# EasyEDA Pro project ProPrj_FRC ESP32 CAN DevKit Lite_2025-11-01.epro, schematic Schematic1
Board Name: Board1; Create Date: 2025-10-21; Page Name: P1; Project Name: FRC ESP32 CAN DevKit Lite; Schematic Name: Schematic1; Update Date: 2025-10-25; Company: 嘉立创EDA; Page Size: A4; Version: V1.0
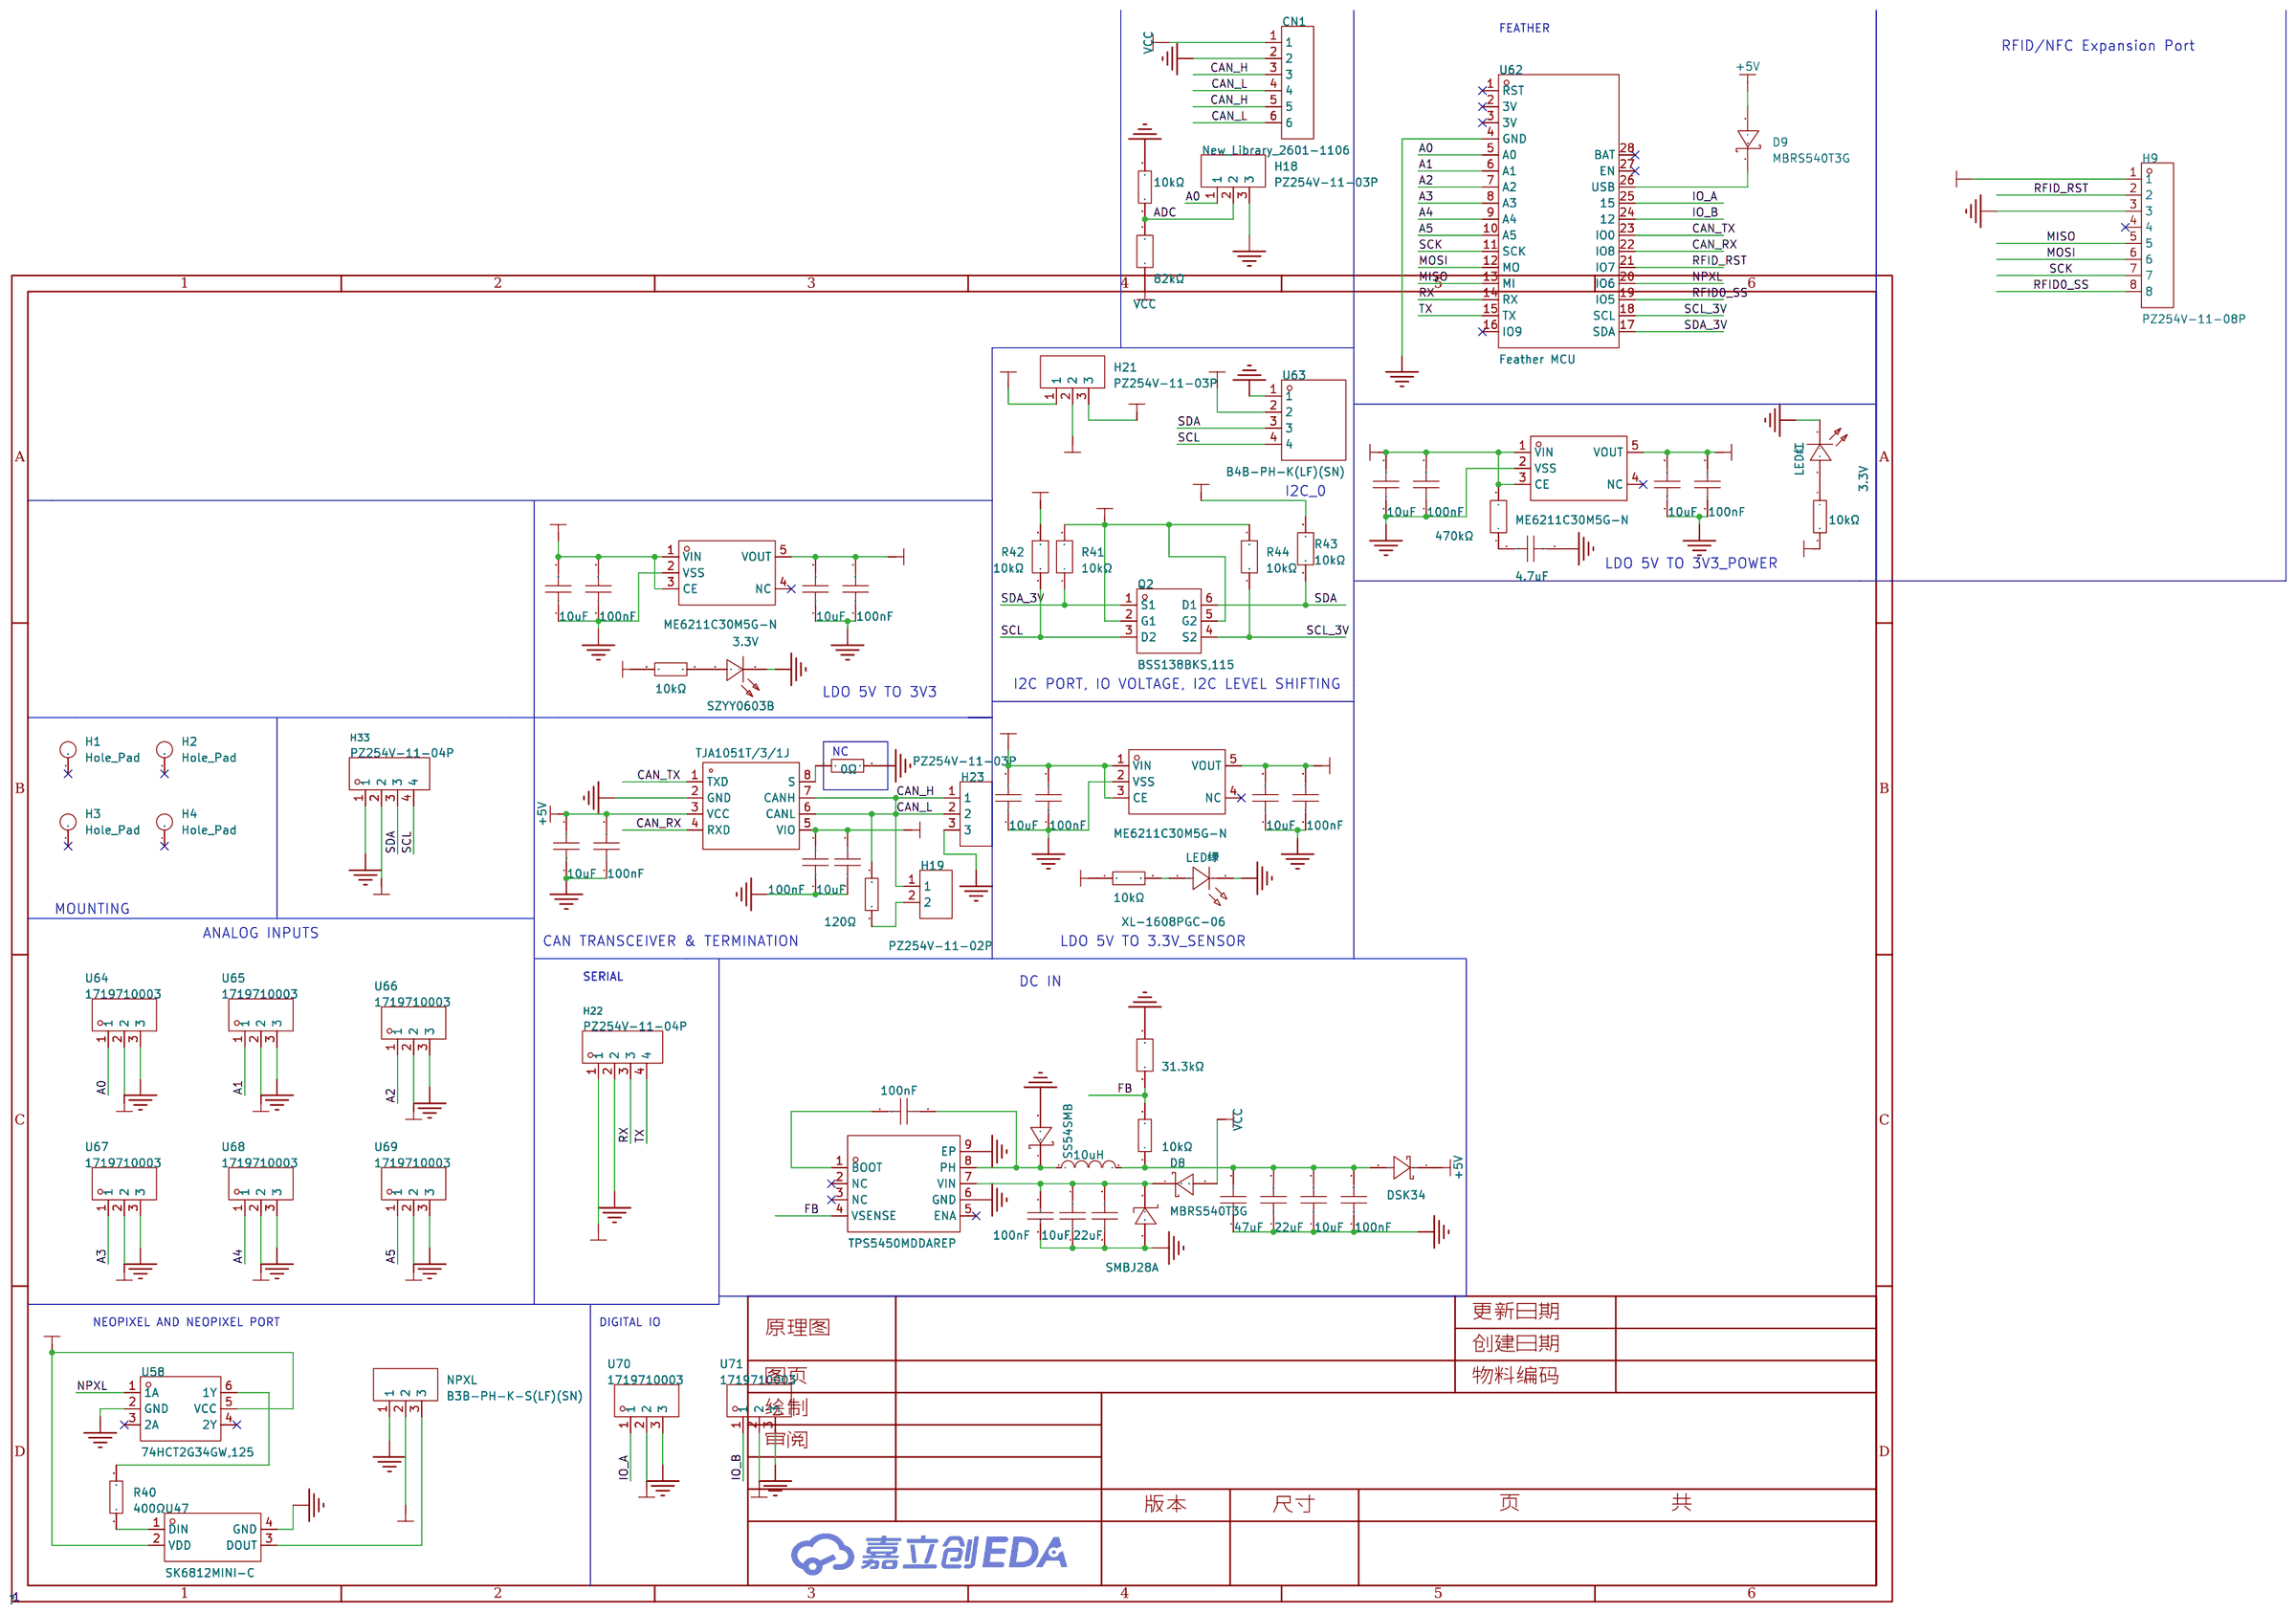
[diagram p0: schematic sheet]

## Parts
3.3V  SZYY0603B  [LED0603-R-RD_BLUE]
C351  10uF  [C0603]
C352  10uF  [C0603]
C353  100nF  [C0603]
C354  100nF  [C0603]
C355  10uF  [C0603]
C356  100nF  [C0603]
C357  10uF  [C0603]
C358  100nF  [C0603]
C369  10uF  [C0603]
C370  10uF  [C0603]
C371  100nF  [C0603]
C372  100nF  [C0603]
C373  10uF  [C0603]
C374  100nF  [C0603]
C375  100nF  [C0603]
C376  10uF  [C0603]
C382  10uF  [C1206]
C383  22uF  [C1206]
C384  100nF  [C1206]
C385  47uF  [C1206]
C386  22uF  [C0805]
C387  10uF  [C0603]
C388  100nF  [C0603]
C389  100nF  [C0603]
C390  4.7uF  [C0603]
CN1  New_Library_2601-1106  [CONN-TH_2601-1106]
D5  SS54SMB  [SMB_L4.6-W3.6-LS5.3-RD]
D6  SMBJ28A  [SMB_L4.6-W3.6-LS5.3-L-FD]
D7  DSK34  [SOD-123FL_L2.7-W1.8-LS3.8-RD]
D8  MBRS540T3G  [SMC_L7.1-W6.2-LS8.1-RD]
D9  MBRS540T3G  [SMC_L7.1-W6.2-LS8.1-RD]
H1  Hole_Pad  [MountingHole:MountingHole_3.2mm_M3_Pad_Via]
H2  Hole_Pad  [MountingHole:MountingHole_3.2mm_M3_Pad_Via]
H3  Hole_Pad  [MountingHole:MountingHole_3.2mm_M3_Pad_Via]
H4  Hole_Pad  [MountingHole:MountingHole_3.2mm_M3_Pad_Via]
H9  PZ254V-11-08P  [HDR-TH_8P-P2.54-V-M]
H18  PZ254V-11-03P  [HDR-TH_3P-P2.54-V-M]
H19  PZ254V-11-02P  [HDR-TH_2P-P2.54-V-M]
H21  PZ254V-11-03P  [HDR-TH_3P-P2.54-V-M]
H22  PZ254V-11-04P  [HDR-TH_4P-P2.54-V-M]
H23  PZ254V-11-03P  [HDR-TH_3P-P2.54-V-M]
H33  PZ254V-11-04P  [HDR-TH_4P-P2.54-V-M]
L12  10uH  [IND-SMD_L5.4-W5.2_FXL0530]
LED红  3.3V  [LED0603-R-RD]
LED绿  XL-1608PGC-06  [LED0603-RD_GREEN]
NPXL  B3B-PH-K-S(LF)(SN)  [CONN-TH_B3B-PH-K-S]
Q2  BSS138BKS,115  [SOT-363_L2.0-W1.3-P0.65-LS2.1-BR]
R11  10kΩ  [R0603]
R15  0Ω  [R0603]
R23  10kΩ  [R0603]
R24  10kΩ  [R0603]
R30  120Ω  [R0603]
R31  82kΩ  [R0603]
R32  10kΩ  [R0603]
R34  10kΩ  [R0603]
R35  31.3kΩ  [R0603]
R36  470kΩ  [R0603]
R40  400Ω  [R1206]
R41  10kΩ  [R0603]
R42  10kΩ  [R0603]
R43  10kΩ  [R0603]
R44  10kΩ  [R0603]
U31  ME6211C30M5G-N  [SOT-23-5_L2.9-W1.6-P0.95-LS2.8-BL]
U34  TJA1051T/3/1J  [SOIC-8_L4.9-W3.9-P1.27-LS6.0-BL]
U40  ME6211C30M5G-N  [SOT-23-5_L2.9-W1.6-P0.95-LS2.8-BL]
U42  ME6211C30M5G-N  [SOT-23-5_L2.9-W1.6-P0.95-LS2.8-BL]
U43  TPS5450MDDAREP  [POWERPAD-SO-8_L4.9-W3.9-P1.27-LS6.0-BL-EP]
U47  SK6812MINI-C  [LED-SMD_4P-L3.5-W3.5-R-SK6812MINI]
U58  74HCT2G34GW,125  [SC-88-6_L2.0-W1.3-P0.65-LS2.1-BL]
U62  Feather MCU  [COMM-TH_L50.8-W22.9-P2.54-LS20.32]
U63  B4B-PH-K(LF)(SN)  [CONN-TH_B4B-PH-K-LF-SN]
U64  1719710003  [CONN-TH_3P-P2.54_171971-0003]
U65  1719710003  [CONN-TH_3P-P2.54_171971-0003]
U66  1719710003  [CONN-TH_3P-P2.54_171971-0003]
U67  1719710003  [CONN-TH_3P-P2.54_171971-0003]
U68  1719710003  [CONN-TH_3P-P2.54_171971-0003]
U69  1719710003  [CONN-TH_3P-P2.54_171971-0003]
U70  1719710003  [CONN-TH_3P-P2.54_171971-0003]
U71  1719710003  [CONN-TH_3P-P2.54_171971-0003]

## Library data of the parts
3.3V = SZYY0603B: 发光颜色:蓝色;功率:100mW;正向电流:5mA;主波长:460nm~475nm;二极管配置:-;透镜颜色:无色透明透镜;色温:-;发光角度:120°;载带方式:-;工作温度:-40℃~+85℃;; LCSC Part Name: 蓝灯; Supplier Part: C434421; Manufacturer: yongyu(永裕光电); Supplier Footprint: 0603; JLCPCB Part Class: 扩展库; Datasheet: https://atta.szlcsc.com/upload/public/pdf/source/20191204/C434421_A4F05E4DF64B0F36639806529E783B5C.pdf; Supplier: LCSC; Emitted Color: 蓝色; Power Dissipation: 100mW; Forward Current: 5mA; Dominant Wavelength: 460nm~475nm; Peak Wavelength: 469nm; Lens Color: 无色透明透镜; Viewing Angle: 120°; Operating Temperature: -40℃~+85℃
C351 C352 C355 C357 C369 C370 C373 C376 C387 = CL10A106MA8NRNC: 容值:10uF;精度:±20%;额定电压:25V;材质(温度系数):X5R;; LCSC Part Name: 10uF ±20% 25V; Supplier Part: C96446; Manufacturer: SAMSUNG(三星); Supplier Footprint: 0603; JLCPCB Part Class: 基础库; Datasheet: https://atta.szlcsc.com/upload/public/pdf/source/20160218/1457707763339.pdf; Supplier: LCSC; Tolerance: ±20%; Voltage Rated: 25V; Temperature Coefficient: X5R
C353 C354 C356 C358 C371 C372 C374 C375 C388 C389 = CGA0603X7R104K500JT: 容值:100nF;精度:±10%;额定电压:50V;温度系数:X7R;; LCSC Part Name: 100nF ±10% 50V; Supplier Part: C6119867; Manufacturer: HRE(芯声); Supplier Footprint: 0603; JLCPCB Part Class: 扩展库; Datasheet: https://atta.szlcsc.com/upload/public/pdf/source/20250103/C44077DA9E7B3EFAE02F22B6D3D1CBC9.pdf; Supplier: LCSC; Tolerance: ±10%; Voltage Rating: 50V; Temperature Coefficient: X7R
C382 = HGC1206R5106K500NSPJ: 容值:10uF;精度:±10%;额定电压:50V;温度系数:X5R;; LCSC Part Name: 10uF ±10% 50V; Supplier Part: C7432781; Manufacturer: Chinocera(华瓷); Supplier Footprint: 1206; JLCPCB Part Class: 扩展库; Datasheet: https://atta.szlcsc.com/upload/public/pdf/source/20240320/FAC3FEC40A78BC5CCCE96C232A94D860.pdf; Supplier: LCSC; Tolerance: ±10%; Voltage Rating: 50V; Temperature Coefficient: X5R
C383 = CGA1206X5R226M350NT: 容值:22uF;精度:±20%;额定电压:35V;温度系数:X5R;; LCSC Part Name: 22uF ±20% 35V; Supplier Part: C6119969; Manufacturer: HRE(芯声); Supplier Footprint: 1206; JLCPCB Part Class: 扩展库; Supplier: LCSC; Tolerance: ±20%; Voltage Rating: 35V; Temperature Coefficient: X5R
C384 = CL31B104KBCNNNC: 容值:100nF;精度:±10%;额定电压:50V;材质(温度系数):X7R;; LCSC Part Name: 100nF ±10% 50V; Supplier Part: C24497; Manufacturer: SAMSUNG(三星); Supplier Footprint: 1206; JLCPCB Part Class: 基础库; Datasheet: https://atta.szlcsc.com/upload/public/pdf/source/20160218/1457707763339.pdf; Supplier: LCSC; Tolerance: ±10%; Voltage Rated: 50V; Temperature Coefficient: X7R
C385 = HGC1206R5476M250NSPJ: 容值:47uF;精度:±20%;额定电压:25V;温度系数:X5R;; LCSC Part Name: 47uF ±20% 25V; Supplier Part: C22367835; Manufacturer: Chinocera(华瓷); Supplier Footprint: 1206; JLCPCB Part Class: 扩展库; Datasheet: https://atta.szlcsc.com/upload/public/pdf/source/20240326/E6CB0DC43BB858B74F4352229FABFDCA.pdf; Supplier: LCSC; Tolerance: ±20%; Voltage Rating: 25V; Temperature Coefficient: X5R
C386 = CGA0805X5R226M350MT: 容值:22uF;精度:±20%;额定电压:35V;材质(温度系数):X5R;; LCSC Part Name: 22uF ±20% 35V; Supplier Part: C6119901; Manufacturer: HRE(芯声); Supplier Footprint: 0805; JLCPCB Part Class: 扩展库; Datasheet: https://atta.szlcsc.com/upload/public/pdf/source/20231129/D589D0CC4D260F7AC3A77E53B455CCB3.pdf; Supplier: LCSC; Tolerance: ±20%; Voltage Rated: 35V; Temperature Coefficient: X5R
C390 = CGA0603X5R475K250JT: 容值:4.7uF;精度:±10%;额定电压:25V;温度系数:X5R;; LCSC Part Name: 4.7uF ±10% 25V; Supplier Part: C6119856; Manufacturer: HRE(芯声); Supplier Footprint: 0603; JLCPCB Part Class: 扩展库; Supplier: LCSC; Tolerance: ±10%; Voltage Rating: 25V; Temperature Coefficient: X5R
CN1 = 2601-1106: Supplier Part: C9900153774; Supplier Footprint: 6P; Supplier: LCSC
D5 = SS54SMB: schottky,5A 40V VF&lt;0.55V DO-214AA SMB; LCSC Part Name: SS54 SMB; Supplier Part: C511854; Manufacturer: BORN(伯恩半导体); Supplier Footprint: SMB; JLCPCB Part Class: 扩展库; Datasheet: https://atta.szlcsc.com/upload/public/pdf/source/20200413/C511854_F7D668554D39129E820C7896E4694DA5.pdf; Supplier: LCSC
D6 = SMBJ28A: 极性:Unidirectional;峰值脉冲电流（10/1000us）:13.2A;箝位电压:45.4V;击穿电压（最小值）:31.1V;反向关断电压（典型值）:28V;; Supplier Part: C356769; Manufacturer: JJW(捷捷微); Supplier Footprint: SMB(DO-214AA); JLCPCB Part Class: 扩展库; Datasheet: https://atta.szlcsc.com/upload/public/pdf/source/20181226/C356769_111367A690C2F4EEBB1E8F2BF22E2686.pdf; Supplier: LCSC
D7 = DSK34_C7502709: 二极管配置:独立式;正向压降(Vf):550mV@3A;直流反向耐压(Vr):40V;平均整流电流(Io):3A;; LCSC Part Name: 电压:40V 电流:3A; Supplier Part: C7502709; Manufacturer: 宏迦橙; Supplier Footprint: SOD-123FL; JLCPCB Part Class: Extended Part; Datasheet: https://atta.szlcsc.com/upload/public/pdf/source/20230828/8ECF110B7E3B5231119B5EFF852BA7DE.pdf; Supplier: LCSC; Diode Configuration: 独立式; Forward Voltage (Vf@If): 550mV@3A; Reverse Voltage (Vr): 40V; Average Rectified Current (Io): 3A; Reverse Leakage Current (Ir): 500uA; Peak forward surge current: 80A
D8 D9 = MBRS540T3G: Voltage - Forward(Vf@If):500mV@5A Voltage - DC Reverse(Vr):40V Current - Rectified:5A Reverse Leakage Current (Ir):300uA@40V Operating Junction Temperature Range:-65℃~+150℃ Operating Junction Temperature Range:-65℃~+150℃ Non-Repetitive Peak Forward Surge; LCSC Part Name: 电压:40V 电流:5A; Supplier Part: C31849; Manufacturer: onsemi(安森美); Supplier Footprint: SMC(DO-214AB); JLCPCB Part Class: Extended Part; Datasheet: https://item.szlcsc.com/datasheet/MBRS540T3G/32808.html; Supplier: LCSC; Voltage - Forward(Vf@If): 500mV@5A; Voltage - DC Reverse(Vr): 40V; Current - Rectified: 5A; Reverse Leakage Current (Ir): 300uA@40V; Operating Junction Temperature Range: -65℃~+150℃; Non-Repetitive Peak Forward Surge Current: 190A
H1-H4 = Mechanical_MountingHole_Pad: Mounting Hole with connection
H9 = PZ254V-11-08P: 插针结构:1x8P;间距:2.54mm;行距:-;圆针/方针:方针;安装类型:直插;排数:单排;总PIN位数:8P;额定电流:-;额定电压:-;配合针长度:6mm;塑高:2.5mm;端接针长度:3mm;触头材质:黄铜;触头镀层:-;工作温度范围:-40℃~+105℃;颜色:黑色;; LCSC Part Name: 间距:2.54mm 1x8P 直插 方针; Supplier Part: C492407; Manufacturer: XFCN(兴飞); Supplier Footprint: 插件,P=2.54mm; JLCPCB Part Class: 扩展库; Datasheet: https://atta.szlcsc.com/upload/public/pdf/source/20200309/C492407_83A6FB26A2233368EDB9516968EC6149.pdf; Supplier: LCSC; Pin Structure: 1x8P; Pitch: 2.54mm; Circluar Pins/Square Pins: 方针; Mounting Type: 直插; Number of Rows: 单排; Number of Pins: 8P; Length of Mating Pin: 6mm; Insulation Height: 2.5mm; Length of End Connection Pin: 3mm; Contact Material: 黄铜; Operating Temperature Range: -40℃~+105℃; Color: 黑色
H18 H21 H23 = PZ254V-11-03P: Pin Structure:1x3P Pitch:2.54mm Row Spacing:- Circluar Pins/Square Pins:Pin Header Mounting Type:Through Hole Number of Rows:1 Number of Pins:3P Current Rating:3A Voltage Rating (Max):250V Length of Mating Pin:6mm Insulation Height:2.5mm Length of End Con; LCSC Part Name: 1x3P 间距:2.54mm 方针 直插; Supplier Part: C2937625; Manufacturer: XFCN(兴飞); Supplier Footprint: 插件,P=2.54mm; JLCPCB Part Class: Extended Part; Datasheet: https://item.szlcsc.com/datasheet/PZ254V-11-03P/3293280.html; Supplier: LCSC; Pin Structure: 1x3P; Pitch: 2.54mm; Circluar Pins/Square Pins: Pin Header; Mounting Type: Through Hole; Number of Rows: 1; Number of Pins: 3P; Current Rating: 3A; Voltage Rating (Max): 250V; Length of Mating Pin: 6mm; Insulation Height: 2.5mm; Length of End Connection Pin: 3mm; Operating Temperature: -40℃~+105℃; Color: Black
H19 = PZ254V-11-02P: Pin Structure:1x2P Pitch:2.54mm Row Spacing:- Circluar Pins/Square Pins:Pin Header Mounting Type:Through Hole Number of Rows:1 Number of Pins:2P Current Rating:- Voltage Rating (Max):- Length of Mating Pin:6mm Insulation Height:2.5mm Length of End Connect; LCSC Part Name: 1x2P 间距:2.54mm 方针 直插; Supplier Part: C492401; Manufacturer: XFCN(兴飞); Supplier Footprint: 插件,P=2.54mm; JLCPCB Part Class: Extended Part; Datasheet: https://item.szlcsc.com/datasheet/PZ254V-11-02P/502957.html; Supplier: LCSC; Pin Structure: 1x2P; Pitch: 2.54mm; Circluar Pins/Square Pins: Pin Header; Mounting Type: Through Hole; Number of Rows: 1; Number of Pins: 2P; Length of Mating Pin: 6mm; Insulation Height: 2.5mm; Length of End Connection Pin: 3mm; Contact Material: Brass; Operating Temperature: -40℃~+105℃; Color: Black
H22 H33 = PZ254V-11-04P: Pin Structure:1x4P Pitch:2.54mm Row Spacing:- Circluar Pins/Square Pins:Pin Header Mounting Type:Through Hole Number of Rows:1 Number of Pins:4P Current Rating:3A Voltage Rating (Max):250V Length of Mating Pin:6mm Insulation Height:2.5mm Length of End Con; LCSC Part Name: 1x4P 间距:2.54mm 方针 直插; Supplier Part: C2691448; Manufacturer: XFCN(兴飞); Supplier Footprint: 插件,P=2.54mm; JLCPCB Part Class: Extended Part; Datasheet: https://item.szlcsc.com/datasheet/PZ254V-11-04P/2801085.html; Supplier: LCSC; Pin Structure: 1x4P; Pitch: 2.54mm; Circluar Pins/Square Pins: Pin Header; Mounting Type: Through Hole; Number of Rows: 1; Number of Pins: 4P; Current Rating: 3A; Voltage Rating (Max): 250V; Length of Mating Pin: 6mm; Insulation Height: 2.5mm; Length of End Connection Pin: 3mm; Operating Temperature: -40℃~+105℃; Color: Black
L12 = FXL0530-100-M: 电感值:10uH;精度:±20%;额定电流:3.2A;饱和电流(Isat):3.5A;类型:一体成型电感;; LCSC Part Name: 10uH ±20% 3.5A; Supplier Part: C177248; Manufacturer: cjiang(长江微电); Supplier Footprint: SMD,5.2x5.4mm; JLCPCB Part Class: 扩展库; Datasheet: https://atta.szlcsc.com/upload/public/pdf/source/20230516/4BF6F9C76E81720F52A39ED5FFFA18B4.pdf; Supplier: LCSC; Tolerance: ±20%; Rated Current: 3.2A; Saturation Current (Isat): 3.5A; DC Resistance (DCR): 125mΩ; Type: 一体成型电感
LED红 = SZYY0603R: 发光颜色:红色;功率:40mW;正向电流:20mA;主波长:615nm~630nm;二极管配置:-;透镜颜色:无色透明透镜;色温:-;发光角度:120°;载带方式:-;工作温度:-40℃~+85℃;; LCSC Part Name: 红灯; Supplier Part: C434419; Manufacturer: yongyu(永裕光电); Supplier Footprint: 0603; JLCPCB Part Class: 扩展库; Datasheet: https://atta.szlcsc.com/upload/public/pdf/source/20191204/C434419_0B955C1F73FF88449D9A795B6FF49070.pdf; Supplier: LCSC; Emitted Color: 红色; Power Dissipation: 40mW; Forward Current: 20mA; Dominant Wavelength: 615nm~630nm; Peak Wavelength: 645nm; Lens Color: 无色透明透镜; Viewing Angle: 120°; Operating Temperature: -40℃~+85℃
LED绿 = XL-1608PGC-06: 灯头类型:-;发光颜色:翠绿色;正向电压(VF):2.6V~3V;功率:75mW;正向电流:5mA;主波长:505nm~540nm;二极管配置:-;透镜颜色:绿色透镜;色温:-;发光强度:299mcd;发光角度:130°;载带方式:正贴;工作温度:-;; Supplier Part: C7371905; Manufacturer: XINGLIGHT(成兴光); Supplier Footprint: 0603; JLCPCB Part Class: 扩展库; Datasheet: https://atta.szlcsc.com/upload/public/pdf/source/20240218/2F8A7AF596DEEB38157DAB7856E382C0.pdf; Supplier: LCSC; Emitted Color: 翠绿色; Forward Voltage (VF): 2.6V~3V; Power Dissipation: 75mW; Forward Current: 5mA; Dominant Wavelength: 505nm~540nm; Peak Wavelength: 530nm; Lens Color: 绿色透镜; Luminous Intensity: 299mcd; Viewing Angle: 130°; Mounting Sytle: 正贴
NPXL = B3B-PH-K-S(LF)(SN): Pins Structure:1x3P Pitch:2mm Mounting Type:Through Hole Reference Series:PH Number of Pins:3P Number of Rows:1 Number of PINs Per Row:3 Row Spacing:- Current Rating:2A Contact Material:Brass Contact Plating:Tin Operating Temperature:-25℃~+85℃ Operating T; LCSC Part Name: 1x3P 间距:2mm 直插 系列:PH; Supplier Part: C131339; Manufacturer: JST; Supplier Footprint: 插件,P=2mm; JLCPCB Part Class: Extended Part; Datasheet: https://item.szlcsc.com/datasheet/B3B-PH-K-S(LF)(SN)/142632.html; Supplier: LCSC; Pins Structure: 1x3P; Pitch: 2mm; Mounting Type: Through Hole; Reference Series: PH; Number of Pins: 3P; Number of Rows: 1; Number of PINs Per Row: 3; Current Rating: 2A; Contact Material: Brass; Contact Plating: Tin; Operating Temperature: -25℃~+85℃; Voltage Rating: 100V; Plastic Material: PA66; Flame Retardant Rating: UL94V-0; Supplementary Features: K Pin; Color: White; Z-Height of the Board: 6mm; X-Length of Bottom Edge on Board (Spacing Line): 7.9mm; Y-Width of Bottom Edge on Board: 4.5mm
Q2 = BSS138BKS,115: Number:2 N-Channel Drain to Source Voltage:60V Current - Continuous Drain(Id):320mA RDS(on):1.6Ω@10V,320mA Pd - Power Dissipation:445mW Gate Threshold Voltage (Vgs(th)):1.6V Gate Charge(Qg):700pC@4.5V Input Capacitance(Ciss):56pF@10V Operating Temperature; LCSC Part Name: 2个N沟道 耐压:60V 电流:320mA; Supplier Part: C456075; Manufacturer: Nexperia(安世); Supplier Footprint: TSSOP-6(SOT-363); JLCPCB Part Class: Extended Part; Datasheet: https://item.szlcsc.com/datasheet/BSS138BKS%252C115/458838.html; Supplier: LCSC; Number: 2 N-Channel; Drain to Source Voltage: 60V; Current - Continuous Drain(Id): 320mA; RDS(on): 1.6Ω@10V,320mA; Pd - Power Dissipation: 445mW; Gate Threshold Voltage (Vgs(th)): 1.6V; Gate Charge(Qg): 700pC@4.5V; Input Capacitance(Ciss): 56pF@10V; Operating Temperature: -55℃~+150℃@(Tj)
R11 R23 R24 R32 = 0603WAF1002T5E: 电阻类型:厚膜电阻;阻值:10kΩ;精度:±1%;功率:100mW;工作电压:75V;温度系数:±100ppm/℃;; LCSC Part Name: 厚膜电阻 10kΩ ±1% 100mW; Supplier Part: C25804; Manufacturer: UNI-ROYAL(厚声); Supplier Footprint: 0603; JLCPCB Part Class: 基础库; Datasheet: https://atta.szlcsc.com/upload/public/pdf/source/20200306/C422600_1E6D84923E4A46A82E41ADD87F860B5C.pdf; Supplier: LCSC; Type: 厚膜电阻; Tolerance: ±1%; Power(Watts): 100mW; Voltage-Supply(Max): 75V; Temperature Coefficient: ±100ppm/℃; Operating Temperature: -55℃~+155℃
R15 = 0603WAF0000T5E: 电阻类型:厚膜电阻;阻值:0Ω;精度:±1%;功率:100mW;最大工作电压:75V;; LCSC Part Name: 0Ω ±1% 100mW 厚膜电阻; Supplier Part: C21189; Manufacturer: UNI-ROYAL(厚声); Supplier Footprint: 0603; JLCPCB Part Class: 基础库; Datasheet: https://atta.szlcsc.com/upload/public/pdf/source/20200306/C422600_1E6D84923E4A46A82E41ADD87F860B5C.pdf; Supplier: LCSC; Type: 厚膜电阻; Tolerance: ±1%; Power(Watts): 100mW; Overload Voltage (Max): 75V; Operating Temperature Range: -55℃~+155℃
R30 = 0603WAF1200T5E: 电阻类型:厚膜电阻;阻值:120Ω;精度:±1%;功率:100mW;最大工作电压:75V;温度系数:±100ppm/℃;; LCSC Part Name: 120Ω ±1% 100mW 厚膜电阻; Supplier Part: C22787; Manufacturer: UNI-ROYAL(厚声); Supplier Footprint: 0603; JLCPCB Part Class: 基础库; Datasheet: https://atta.szlcsc.com/upload/public/pdf/source/20200306/C422600_1E6D84923E4A46A82E41ADD87F860B5C.pdf; Supplier: LCSC; Type: 厚膜电阻; Tolerance: ±1%; Power(Watts): 100mW; Overload Voltage (Max): 75V; Temperature Coefficient: ±100ppm/℃; Operating Temperature Range: -55℃~+155℃
R31 = FRC0603F8202TS: 电阻类型:厚膜电阻;阻值:82kΩ;精度:±1%;功率:100mW;工作电压:75V;温度系数:±100ppm/℃;; LCSC Part Name: 82kΩ ±1% 100mW 厚膜电阻; Supplier Part: C2907072; Manufacturer: FOJAN(富捷); Supplier Footprint: 0603; JLCPCB Part Class: 扩展库; Datasheet: https://atta.szlcsc.com/upload/public/pdf/source/20211221/925EC7D7225764EE0046F22065062C87.pdf; Supplier: LCSC; Type: 厚膜电阻; Tolerance: ±1%; Power(Watts): 100mW; Voltage-Supply(Max): 75V; Temperature Coefficient: ±100ppm/℃; Operating Temperature: -55℃~+155℃
R34 = 0603WAF1002T5E: Type:Thick Film Resistor Resistance:10kΩ Tolerance:±1% Tolerance:±1% Power(Watts):100mW Voltage-Supply(Max):75V Temperature Coefficient:±100ppm/℃ Temperature Coefficient:±100ppm/℃ Operating Temperature:-55℃~+155℃ Operating Temperature:-55℃~+155℃; LCSC Part Name: 厚膜电阻 10kΩ ±1% 100mW; Supplier Part: C25804; Manufacturer: UNI-ROYAL(厚声); Supplier Footprint: 0603; JLCPCB Part Class: Basic Part; Datasheet: https://item.szlcsc.com/datasheet/0603WAF1002T5E/26547.html; Supplier: LCSC; Type: Thick Film Resistor; Tolerance: ±1%; Power(Watts): 100mW; Voltage-Supply(Max): 75V; Temperature Coefficient: ±100ppm/℃; Operating Temperature: -55℃~+155℃
R35 = 0603WAF3132T5E: Type:Thick Film Resistors Resistance:31.3kΩ Tolerance:±1% Tolerance:±1% Power(Watts): Overload Voltage (Max): Temperature Coefficient:±100ppm/℃ Temperature Coefficient:±100ppm/℃ Operating Temperature Range:-55℃~+155℃ Operating Temperature Range:-55℃~+155℃; LCSC Part Name: 31.3kΩ ±1% 100mW 厚膜电阻; Supplier Part: C2767176; Manufacturer: UNI-ROYAL(厚声); Supplier Footprint: 0603; JLCPCB Part Class: Extended Part; Datasheet: https://atta.szlcsc.com/upload/public/pdf/source/20200306/C422600_1E6D84923E4A46A82E41ADD87F860B5C.pdf; Supplier: LCSC; Type: Thick Film Resistors; Tolerance: ±1%; Temperature Coefficient: ±100ppm/℃; Operating Temperature Range: -55℃~+155℃
R36 = FRC0603F4703TS: 电阻类型:厚膜电阻;阻值:470kΩ;精度:±1%;功率:100mW;工作电压:75V;温度系数:±100ppm/℃;; LCSC Part Name: 470kΩ ±1% 100mW 厚膜电阻; Supplier Part: C2907040; Manufacturer: FOJAN(富捷); Supplier Footprint: 0603; JLCPCB Part Class: 扩展库; Datasheet: https://atta.szlcsc.com/upload/public/pdf/source/20211221/925EC7D7225764EE0046F22065062C87.pdf; Supplier: LCSC; Type: 厚膜电阻; Tolerance: ±1%; Power(Watts): 100mW; Voltage-Supply(Max): 75V; Temperature Coefficient: ±100ppm/℃; Operating Temperature: -55℃~+155℃
R40 = RT1206BRD07400RL: Type:Thin Film Resistor Resistance:400Ω Tolerance:±0.1% Tolerance:±0.1% Power(Watts):250mW Voltage-Supply(Max):200V Temperature Coefficient:±25ppm/℃ Temperature Coefficient:±25ppm/℃ Operating Temperature:-55℃~+155℃ Operating Temperature:-55℃~+155℃; LCSC Part Name: 薄膜电阻 400Ω ±0.1% 250mW; Supplier Part: C706413; Manufacturer: YAGEO(国巨); Supplier Footprint: 1206; JLCPCB Part Class: Extended Part; Datasheet: https://item.szlcsc.com/datasheet/RT1206BRD07400RL/742933.html; Supplier: LCSC; Type: Thin Film Resistor; Tolerance: ±0.1%; Power(Watts): 250mW; Voltage-Supply(Max): 200V; Temperature Coefficient: ±25ppm/℃; Operating Temperature: -55℃~+155℃
R41-R44 = CRG0603J10K: Type:Thick Film Resistor Resistance:10kΩ Tolerance:±5% Tolerance:±5% Power(Watts):100mW Voltage-Supply(Max):75V Temperature Coefficient:±200ppm/℃ Temperature Coefficient:±200ppm/℃ Operating Temperature:-55℃~+155℃ Operating Temperature:-55℃~+155℃; LCSC Part Name: 厚膜电阻 10kΩ ±5% 100mW; Supplier Part: C2073745; Manufacturer: TE Connectivity(泰科电子); Supplier Footprint: 0603; JLCPCB Part Class: Extended Part; Datasheet: https://item.szlcsc.com/datasheet/CRG0603J10K/2165331.html; Supplier: LCSC; Type: Thick Film Resistor; Tolerance: ±5%; Power(Watts): 100mW; Voltage-Supply(Max): 75V; Temperature Coefficient: ±200ppm/℃; Operating Temperature: -55℃~+155℃
U31 U40 U42 = ME6211C30M5G-N: 输出类型:固定;最大输入电压:6V;输出电压:3V;最大输出电流:500mA;电源纹波抑制比(PSRR):-;输出极性:正极;; LCSC Part Name: 输入6V 输出3V 500mA; Supplier Part: C403651; Manufacturer: MICRONE(南京微盟); Supplier Footprint: SOT-23-5; JLCPCB Part Class: 扩展库; Datasheet: https://atta.szlcsc.com/upload/public/pdf/source/20190709/C403651_B6C31F2E850C49363974D5C4E4AF6FD2.pdf; Supplier: LCSC; Output Type: 固定; Maximum Input Voltage: 6V; Output Voltage: 3V; MAX Output Current: 500mA; Dropout Voltage: 210mV@(200mA); Output Polarity: 正极; Number of Outputs: 1
U34 = TJA1051T/3/1J: 类型:-;数据速率:5Mbps;; Supplier Part: C38695; Manufacturer: NXP(恩智浦); Supplier Footprint: SOIC-8-150mil; JLCPCB Part Class: 扩展库; Datasheet: https://www.nxp.com/docs/en/data-sheet/TJA1051.pdf; Supplier: LCSC; Data Rate: 5Mbps; Supply Voltage: 4.5V~5.5V; Supply Current: 5mA; Operating Temperature: -40℃~+150℃
U43 = TPS5450MDDAREP: 功能类型:降压型;输出类型:可调;工作电压:5.5V~36V;输出电压:1.221V~32.04V;输出电流:5A;; Supplier Part: C2071671; Manufacturer: TI(德州仪器); Supplier Footprint: SO-8; JLCPCB Part Class: 扩展库; Datasheet: https://www.ti.com/cn/lit/gpn/tps5450-ep; Supplier: LCSC; Function: 降压型; Output Type: 可调; Voltage - Supply: 5.5V~36V; Output Voltage: 1.221V~32.04V; Output Current: 5A; Frequency - Switching: 500kHz; Operating Temperature: -55℃~+125℃@(TJ); Synchronous Rectifier: 否; Number of Outputs: 1; Topology: 降压式; Switch tube (built-in/external): 内置
U47 = SK6812MINI-C: Wavelength:R:615nm~625nm；B:460nm~470nm；G:520nm~530nm Luminous Intensity:B:160mcd~320mcd；R:280mcd~515mcd；G:815mcd~1275mcd Fixed-Frequency Pwm Mode:1kHz Voltage - Supply:3.7V~5.5V Voltage - Supply:3.7V~5.5V Quiescent Current:0.65mA ESD Withstand Voltage:200; Supplier Part: C7423117; Manufacturer: 欧思科光电; Supplier Footprint: SMD,3.5x3.7mm; JLCPCB Part Class: Extended Part; Datasheet: https://item.szlcsc.com/datasheet/SK6812MINI-C/8407590.html; Supplier: LCSC; Wavelength: R:615nm~625nm；B:460nm~470nm；G:520nm~530nm; Luminous Intensity: B:160mcd~320mcd；R:280mcd~515mcd；G:815mcd~1275mcd; Fixed-Frequency Pwm Mode: 1kHz; Voltage - Supply: 3.7V~5.5V; Quiescent Current: 0.65mA; ESD Withstand Voltage: 2000V; Operating Temperature: -40℃~+85℃; Viewing Angle: 120°; Length: 3.5mm; Width: 1.1mm; Height: 3.7mm
U58 = 74HCT2G34GW,125: Input type:- output type:推挽 Supply Voltage:4.5V~5.5V Supply Voltage:4.5V~5.5V Number of Elements:2 Number of Bits per Element:1 Sink Current:4mA Source Current:4mA Logic Family:74HCT Operating Temperature:-40℃~+125℃ Operating Temperature:-40℃~+125℃; Supplier Part: C458804; Manufacturer: Nexperia(安世); Supplier Footprint: SC-88; JLCPCB Part Class: Extended Part; Datasheet: https://atta.szlcsc.com/upload/public/pdf/source/20191121/C458804_AE83470BE526E18F3A50418A20684336.pdf; Supplier: LCSC; output type: 推挽; Supply Voltage: 4.5V~5.5V; Number of Elements: 2; Number of Bits per Element: 1; Sink Current: 4mA; Source Current: 4mA; Logic Family: 74HCT; Operating Temperature: -40℃~+125℃
U62 = ESP32-C6-Feather: Supplier Part: C9900163338; Supplier Footprint: 插件; Supplier: LCSC
U63 = B4B-PH-K(LF)(SN): Pins Structure:1x4P Pitch:2mm Mounting Style:Straight Reference Series:PH Number of Pins:4P Number of Rows:1 Number of PINs Per Row:4 Row Spacing:- Current Rating (Max):2A Contact Material:Brass Contact Plating:Tin Operating Temperature Range:-25℃~+85℃ Op; LCSC Part Name: 1x4P 间距:2mm 直插 系列:PH; Supplier Part: C265289; Manufacturer: JST; Supplier Footprint: 插件,P=2mm; JLCPCB Part Class: Extended Part; Datasheet: https://atta.szlcsc.com/upload/public/pdf/source/20200309/C265361_D965BED2646773197A138A0135463E69.pdf; Supplier: LCSC; Pins Structure: 1x4P; Pitch: 2mm; Mounting Style: Straight; Reference Series: PH; Number of Pins: 4P; Number of Rows: 1; Number of PINs Per Row: 4; Current Rating (Max): 2A; Contact Material: Brass; Contact Plating: Tin; Operating Temperature Range: -25℃~+85℃; Rated Voltage (Max): 100V; Plastic Material: PA66; Flame Retardant Rating: UL94V-0; Supplementary Features: 打K脚; Colour: White; Z-Height of the Board: 6mm; X-Length of Bottom Edge on Board (Spacing Line): 9.9mm; Y-Width of Bottom Edge on Board: 4.5mm
U64-U71 = 1719710003: Pitch:2.54mm Number of Pins:3P Number of Rows:1 Current Rating:3A Contact Material:Brass Contact Plating:Tin Operating Temperature:-40℃~+105℃ Operating Temperature:-40℃~+105℃ Voltage Rating:250V Color:Black; LCSC Part Name: 间距:2.54mm; Supplier Part: C586606; Manufacturer: MOLEX; Supplier Footprint: 插件,P=2.54mm; JLCPCB Part Class: Extended Part; Supplier: LCSC; Pitch: 2.54mm; Number of Pins: 3P; Number of Rows: 1; Current Rating: 3A; Contact Material: Brass; Contact Plating: Tin; Operating Temperature: -40℃~+105℃; Voltage Rating: 250V; Color: Black

## Nets
3V3: C352.2 C354.2 C357.2 C358.2 R11.2 U31.5(VOUT) U34.5(VIO)
3V3_POWER: C373.2 C375.2 H21.3 Q2.2(G1) Q2.5(G2) R24.2 R41.2 R44.2 U42.5(VOUT)
+5V: C351.2 C353.2 C355.2 C356.2 C369.2 C371.2 C374.2 C376.2 D7.1(K) D9.2(A) H21.1 NPXL.2 R36.2 U31.1(VIN) U31.3(CE) U34.3(VCC) U40.1(VIN) U40.3(CE) U42.1(VIN) U42.3(CE) U47.2(VDD) U58.5(VCC)
GND: 3.3V.2(-) C351.1 C352.1 C353.1 C354.1 C355.1 C356.1 C357.1 C358.1 C369.1 C370.1 C371.1 C372.1 C373.1 C374.1 C375.1 C376.1 C382.1 C383.1 C384.1 C385.1 C386.1 C387.1 C388.1 C390.1 CN1.2 D5.2(A) D6.1(A) H9.3 H18.3 H22.2 H23.3 H33.1 LED红.2(-) LED绿.1(K) NPXL.1 R15.2 R32.1 R35.2 U31.2(VSS) U34.2(GND) U40.2(VSS) U42.2(VSS) U43.6(GND) U43.9(EP) U47.4(GND) U58.2(GND) U62.4(GND) U63.1 U64.3 U65.3 U66.3 U67.3 U68.3 U69.3 U70.3 U71.3
VCC: CN1.1 D8.2(A) R31.1
3.3_SENSOR: C370.2 C372.2 H9.1 H22.1 R23.2 U40.5(VOUT) U64.2 U65.2 U66.2 U67.2 U68.2 U69.2 U70.2 U71.2
A0: H18.1 U62.5(A0) U64.1
A1: U62.6(A1) U65.1
A2: U62.7(A2) U66.1
A3: U62.8(A3) U67.1
A4: U62.9(A4) U68.1
A5: U62.10(A5) U69.1
ADC: H18.2 R31.2 R32.2
CAN_H: CN1.3 CN1.5 H19.1 H23.1 U34.7(CANH)
CAN_L: CN1.4 CN1.6 H23.2 R30.2 U34.6(CANL)
CAN_RX: U34.4(RXD) U62.22(IO8)
CAN_TX: U34.1(TXD) U62.23(IO0)
FB: R34.2 R35.1 U43.4(VSENSE)
IO_A: U62.25(15) U70.1
IO_B: U62.24(12) U71.1
IO_PWR: H21.2 H33.2 R42.2 R43.2 U63.2
MISO: H9.5 U62.13(MI)
MOSI: H9.6 U62.12(MO)
NPXL: U58.1(1A) U62.20(IO6)
RFID0_SS: H9.8 U62.19(IO5)
RFID_RST: H9.2 U62.21(IO7)
RX: H22.3 U62.14(RX)
SCK: H9.7 U62.11(SCK)
SCL: H33.4 Q2.3(D2) R42.1 U63.4
SCL_3V: Q2.4(S2) R44.1 U62.18(SCL)
SDA: H33.3 Q2.6(D1) R43.1 U63.3
SDA_3V: Q2.1(S1) R41.1 U62.17(SDA)
TX: H22.4 U62.15(TX)
$1N3538: 3.3V.1(+) R11.1
$1N6214: R15.1 U34.8(S)
$1N6447: H19.2 R30.1
$1N10830: LED绿.2(A) R23.1
$1N11549: LED红.1(+) R24.1
$1N13604: C382.2 C383.2 C384.2 D6.2(K) D8.1(C) U43.7(VIN)
$1N13650: C389.1 D5.1(K) L12.1 U43.8(PH)
$1N13751: C385.2 C386.2 C387.2 C388.2 D7.2(A) L12.2 R34.1
$1N13789: C389.2 U43.1(BOOT)
$1N38886: C390.2 R36.1
$1N70923: R40.1 U47.1(DIN)
$1N109686: NPXL.3 U47.3(DOUT)
$1N109877: R40.2 U58.6(1Y)
$1N138044: D9.1(C) U62.26(USB)

Not connected (* = marked no-connect by the designer): H1 1*; H2 1*; H3 1*; H4 1*; H9 4*; U31 4(NC)*; U40 4(NC)*; U42 4(NC)*; U43 2(NC)* 3(NC)* 5(ENA)*; U58 3(2A)* 4(2Y)*; U62 1(RST)* 2(3V)* 3(3V)* 16(IO9)* 27(EN)* 28(BAT)*

## Notes on the sheet
- FEATHER
- RFID/NFC Expansion Port
- I2C_0
- LDO 5V TO 3V3_POWER
- LDO 5V TO 3V3
- I2C PORT, IO VOLTAGE, I2C LEVEL SHIFTING
- NC
- MOUNTING
- ANALOG INPUTS
- CAN TRANSCEIVER & TERMINATION
- LDO 5V TO 3.3V_SENSOR
- SERIAL
- SERIAL
- DC IN
- NEOPIXEL AND NEOPIXEL PORT
- DIGITAL IO
